# EAGLE board dr1_h (EAGLE 6.4)
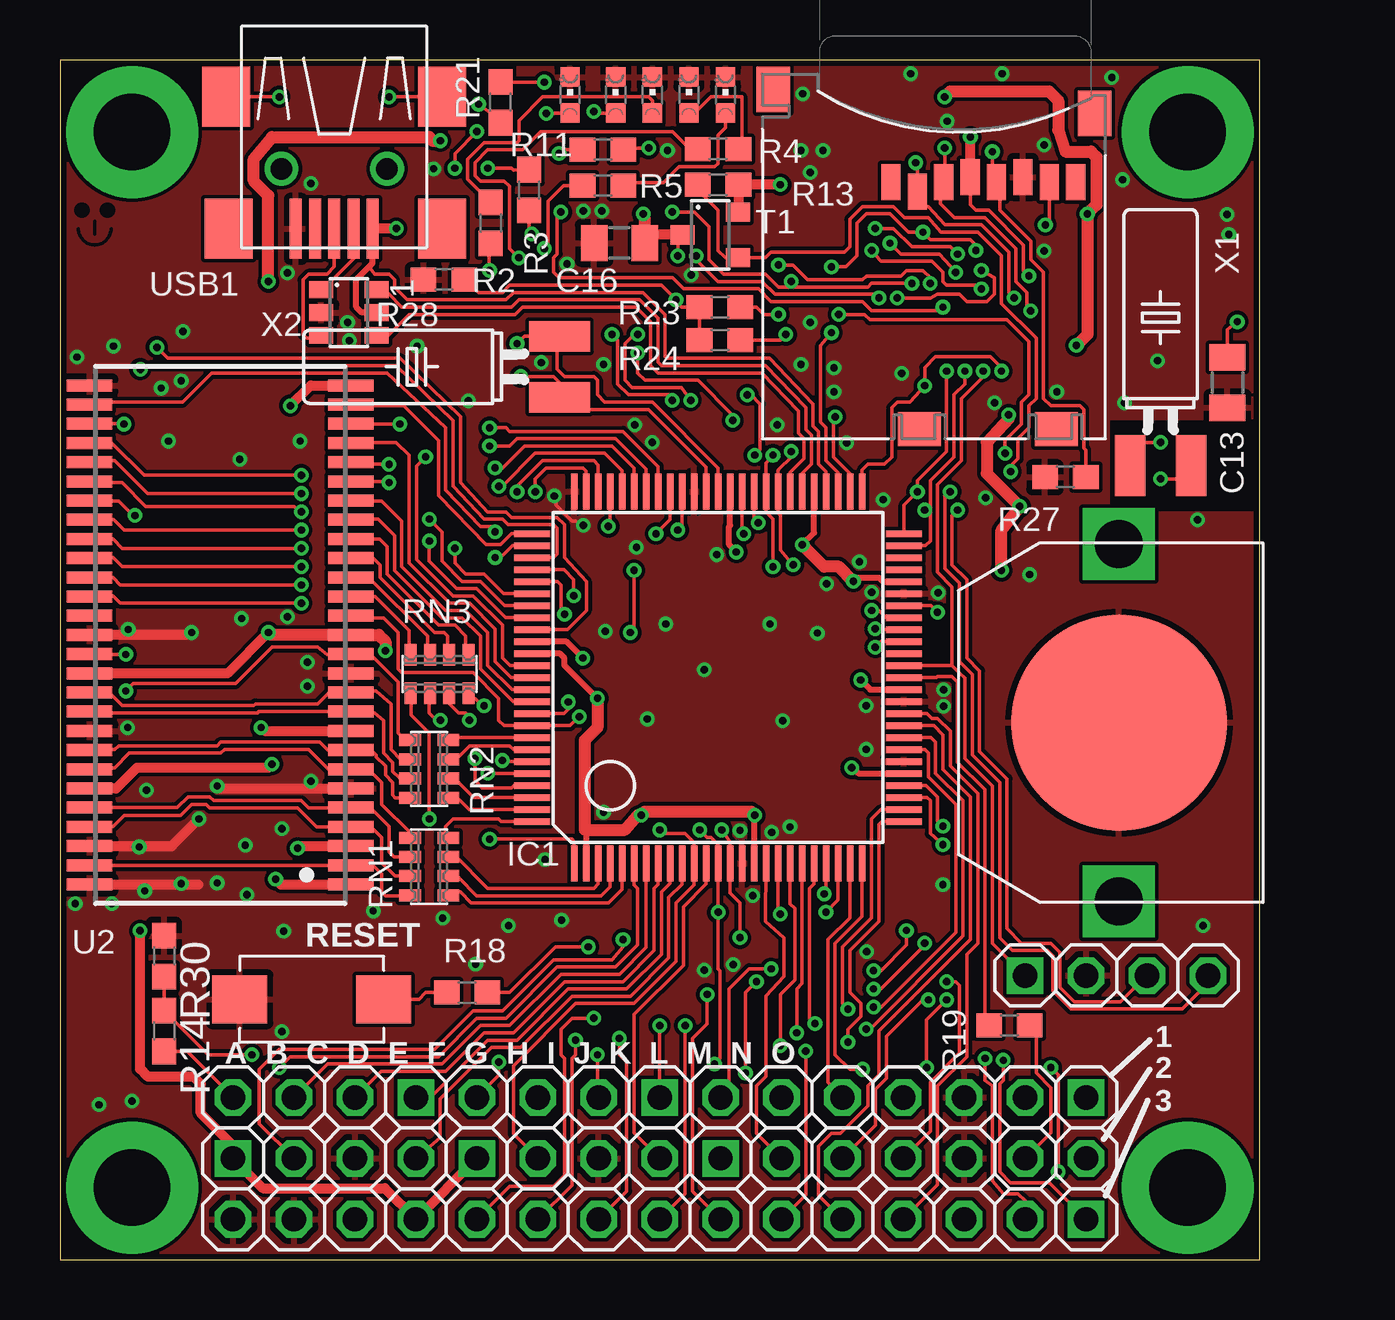
[diagram p1: board, top side]
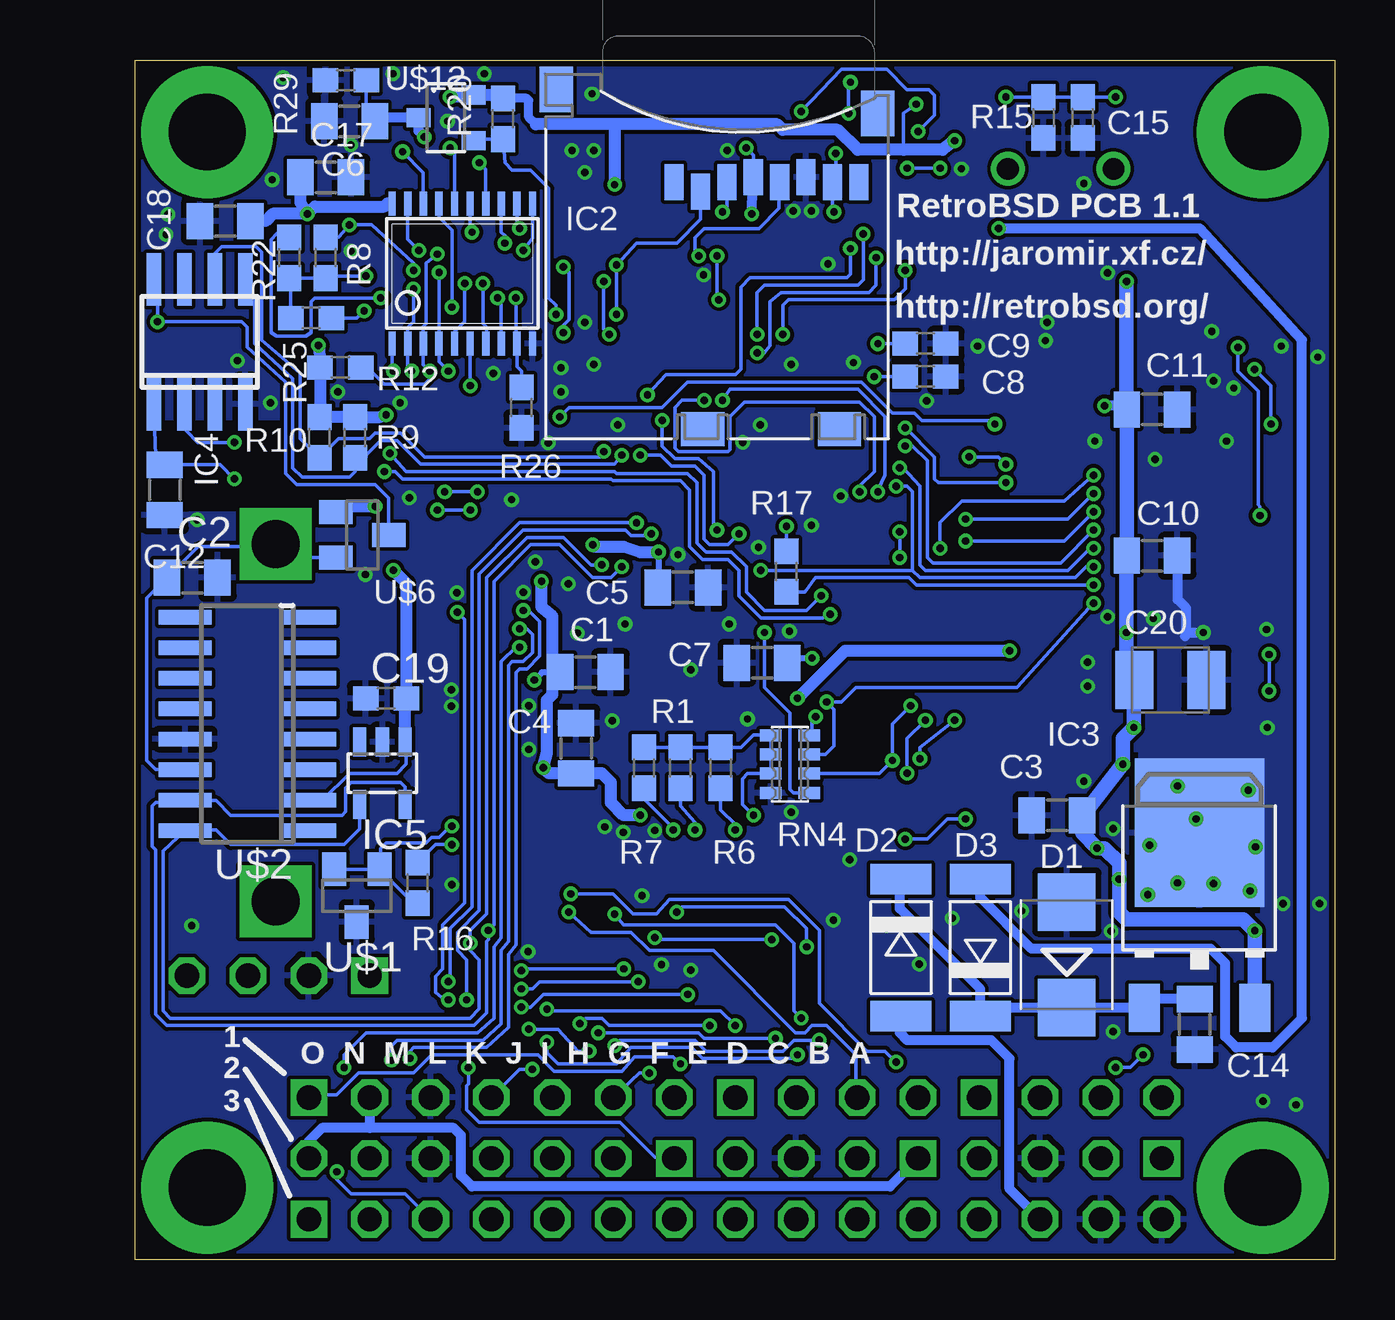
[diagram p2: board, bottom side, seen from below]

Size 50 x 50 mm. Coordinates in mm from the lower left corner, seen from the top.
Outline: 0,0 50,0 50,50 0,50 0,0
Copper layers (1*16): Top 0.035mm / dielectric 1.5mm / Bottom 0.035mm
Design rules "ITead_rule": minimum track width 6mil, minimum drill 12mil, track to track 6mil, track to pad 6mil, pad to pad 6mil, via to via 6mil, smd to smd 0mil, copper to edge 10mil, drill to drill 10mil, minimum pad ring 10mil, minimum via ring 6mil, stop-mask expansion 2mil, vias tented up to drill 100mil, thermal gap 10mil
tRestrict: area 0.7,43.5 to 1.2,44; area 1.7,43.5 to 2.2,44; 2 lines

## Footprints (pad centres in the part's own frame; a part is rotated, then mirrored left to right if it is on the bottom)
SOT23-6 = smd 0.7 x 1: 1 -0.95,-1.15; 2 0,-1.15; 3 0.95,-1.15; 4 0.95,1.15; 5 0,1.15; 6 -0.95,1.15
BATT_KEYS3001 = smd 9 x 9: NEG 0,0 | drill 2 square: POS1 7.45,0; POS2 -7.45,0
R0805 = smd 1.1 x 1.5: 1 -1.05,0; 2 1.05,0
0603 = smd 1.067 x 1: 1 -0.85,0; 2 0.85,0
SMC_B = smd 1.6 x 2.4: + -1.5,0; - 1.5,0
SMB = smd 2.4 x 2.4: A 2.2,0; C -2.2,0
SM-1 = smd 1.27 x 2.54: A 2.857,0; K -2.857,0
TQFP100 = smd 0.27 x 1.5: 1 -6,-9.02; 2 -5.5,-9.02; 3 -5,-9.02; 4 -4.5,-9.02; 5 -4,-9.02; 6 -3.5,-9.02; 7 -3,-9.02; 8 -2.5,-9.02; 9 -2,-9.02; 10 -1.5,-9.02; 11 -1,-9.02; 12 -0.5,-9.02; 13 0,-9.02; 14 0.5,-9.02; 15 1,-9.02; 16 1.5,-9.02; 17 2,-9.02; 18 2.5,-9.02; 19 3,-9.02; 20 3.5,-9.02; 21 4,-9.02; 22 4.5,-9.02; 23 5,-9.02; 24 5.5,-9.02; 25 6,-9.02; 51 6,6.48; 52 5.5,6.48; 53 5,6.48; 54 4.5,6.48; 55 4,6.48; 56 3.5,6.48; 57 3,6.48; 58 2.5,6.48; 59 2,6.48; 60 1.5,6.48; 61 1,6.48; 62 0.5,6.48; 63 0,6.48; 64 -0.5,6.48; 65 -1,6.48; 66 -1.5,6.48; 67 -2,6.48; 68 -2.5,6.48; 69 -3,6.48; 70 -3.5,6.48; 71 -4,6.48; 72 -4.5,6.48; 73 -5,6.48; 74 -5.5,6.48; 75 -6,6.48 | smd 1.5 x 0.27: 26 7.75,-7.27; 27 7.75,-6.77; 28 7.75,-6.27; 29 7.75,-5.77; 30 7.75,-5.27; 31 7.75,-4.77; 32 7.75,-4.27; 33 7.75,-3.77; 34 7.75,-3.27; 35 7.75,-2.77; 36 7.75,-2.27; 37 7.75,-1.77; 38 7.75,-1.27; 39 7.75,-0.77; 40 7.75,-0.27; 41 7.75,0.23; 42 7.75,0.73; 43 7.75,1.23; 44 7.75,1.73; 45 7.75,2.23; 46 7.75,2.73; 47 7.75,3.23; 48 7.75,3.73; 49 7.75,4.23; 50 7.75,4.73; 76 -7.75,4.73; 77 -7.75,4.23; 78 -7.75,3.73; 79 -7.75,3.23; 80 -7.75,2.73; 81 -7.75,2.23; 82 -7.75,1.73; 83 -7.75,1.23; 84 -7.75,0.73; 85 -7.75,0.23; 86 -7.75,-0.27; 87 -7.75,-0.77; 88 -7.75,-1.27; 89 -7.75,-1.77; 90 -7.75,-2.27; 91 -7.75,-2.77; 92 -7.75,-3.27; 93 -7.75,-3.77; 94 -7.75,-4.27; 95 -7.75,-4.77; 96 -7.75,-5.27; 97 -7.75,-5.77; 98 -7.75,-6.27; 99 -7.75,-6.77; 100 -7.75,-7.27
TSSOP20 = smd 0.305 x 0.991: 1 -3.025,-2.818; 2 -2.375,-2.818; 3 -1.725,-2.818; 4 -1.075,-2.818; 5 -0.425,-2.818; 6 0.225,-2.818; 7 0.875,-2.818; 8 1.525,-2.818; 9 2.175,-2.818; 10 2.825,-2.818; 11 2.825,3.018; 12 2.175,3.018; 13 1.525,3.018; 14 0.875,3.018; 15 0.225,3.018; 16 -0.425,3.018; 17 -1.075,3.018; 18 -1.725,3.018; 19 -2.375,3.018; 20 -3.025,3.018
DPAK = smd 1.3 x 2: 1 -2.3,-4.793; 3 2.3,-4.793 | smd 5.4 x 6.2: 4 -0.01,2.5
SO-08 = smd 0.6 x 2.2: 1 -1.905,-2.6; 2 -0.635,-2.6; 3 0.635,-2.6; 4 1.905,-2.6; 5 1.905,2.6; 6 0.635,2.6; 7 -0.635,2.6; 8 -1.905,2.6
SOT23-5L = smd 0.55 x 1.2: 1 -0.95,-1.3; 2 0,-1.3; 3 0.95,-1.3; 4 0.95,1.3; 5 -0.95,1.3
1X15-S = drill 1.016 square: 1 -17.78,0 | drill 1.016 octagon: 2 -15.24,0; 3 -12.7,0; 4 -10.16,0; 5 -7.62,0; 6 -5.08,0; 7 -2.54,0; 8 0,0; 9 2.54,0; 10 5.08,0; 11 7.62,0; 12 10.16,0; 13 12.7,0; 14 15.24,0; 15 17.78,0
1X04-S = drill 1.016 square: 1 -3.81,0 | drill 1.016 octagon: 2 -1.27,0; 3 1.27,0; 4 3.81,0
1X07-S = drill 1.016 square: 1 -7.62,0 | drill 1.016 octagon: 2 -5.08,0; 3 -2.54,0; 4 0,0; 5 2.54,0; 6 5.08,0; 7 7.62,0
CHIPLED_0603 = smd 0.8 x 0.8: A 0,-0.75; C 0,0.75
CTS742C083 = smd 0.5 x 0.9: 1 -1.2,-0.8; 2 -0.4,-0.8; 3 0.4,-0.8; 4 1.2,-0.8; 5 1.2,0.8; 6 0.4,0.8; 7 -0.4,0.8; 8 -1.2,0.8
MICROSD = smd 0.8 x 1.5: 1 -1.94,2.7; 2 -0.84,2.3; 3 0.26,2.7; 4 1.36,2.9; 5 2.46,2.7; 6 3.56,2.9; 7 4.66,2.7; 8 5.76,2.7 | smd 1.4 x 1.9: NC -6.85,6.55; NC3 6.55,5.55 | smd 1.8 x 1.4: NC1 -0.75,-7.6; NC2 4.95,-7.6
SOT23-3 = smd 0.8 x 1: 1 0.91,1.13; 2 -0.99,1.13; 3 -0.04,-1.17
TSOP54 = smd 0.5 x 1.9: 1 -10.4,-5.45; 2 -9.6,-5.45; 3 -8.8,-5.45; 4 -8,-5.45; 5 -7.2,-5.45; 6 -6.4,-5.45; 7 -5.6,-5.45; 8 -4.8,-5.45; 9 -4,-5.45; 10 -3.2,-5.45; 11 -2.4,-5.45; 12 -1.6,-5.45; 13 -0.8,-5.45; 14 0,-5.45; 15 0.8,-5.45; 16 1.6,-5.45; 17 2.4,-5.45; 18 3.2,-5.45; 19 4,-5.45; 20 4.8,-5.45; 21 5.6,-5.45; 22 6.4,-5.45; 23 7.2,-5.45; 24 8,-5.45; 25 8.8,-5.45; 26 9.6,-5.45; 27 10.4,-5.45; 28 10.4,5.45; 29 9.6,5.45; 30 8.8,5.45; 31 8,5.45; 32 7.2,5.45; 33 6.4,5.45; 34 5.6,5.45; 35 4.8,5.45; 36 4,5.45; 37 3.2,5.45; 38 2.4,5.45; 39 1.6,5.45; 40 0.8,5.45; 41 0,5.45; 42 -0.8,5.45; 43 -1.6,5.45; 44 -2.4,5.45; 45 -3.2,5.45; 46 -4,5.45; 47 -4.8,5.45; 48 -5.6,5.45; 49 -6.4,5.45; 50 -7.2,5.45; 51 -8,5.45; 52 -8.8,5.45; 53 -9.6,5.45; 54 -10.4,5.45
SOT23 = smd 1 x 1.4: 1 -0.95,-1.1; 2 0.95,-1.1; 3 0,1.1
SO-16 = smd 0.6 x 2.2: 1 -4.445,-2.917; 2 -3.175,-2.917; 3 -1.905,-2.917; 4 -0.635,-2.917; 5 0.635,-2.917; 6 1.905,-2.917; 7 3.175,-2.917; 8 4.445,-2.917; 9 4.445,2.283; 10 3.175,2.283; 11 1.905,2.283; 12 0.635,2.283; 13 -0.635,2.283; 14 -1.905,2.283; 15 -3.175,2.283; 16 -4.445,2.283
SW_SMD_MINI = smd 2.3 x 2: 1 3,0; 2 -3,0
USB-MB-S = smd 2.5 x 0.5: D+ 2.5,0; D- 2.5,0.8; GND 2.5,-1.6; ID 2.5,-0.8; VBUS 2.5,1.6 | smd 2.5 x 2: GND@1 -3,4.5; GND@2 2.5,4.5; GND@3 -3,-4.5; GND@4 2.5,-4.4 | drill 0.9: P$5 0,2.2; P$6 0,-2.2
TC38 = smd 1.27 x 2.54: P$1 -1.27,-4.572; P$2 1.27,-4.572

## Placement (x,y rotation side)
1  WE_TVS_2USB  [SOT23-6]  12.04,39.47 270 top
B1  BATT_3001  [BATT_KEYS3001]  44.15,22.38 270 top
C1  1U  [R0805]  31.24,24.49 0 bottom
C2  1U  [R0805]  47.62,28.42 0 bottom
C3  10U  [R0805]  11.58,18.52 180 bottom
C4  10U  [R0805]  31.62,21.31 90 bottom
C5  1U  [R0805]  27.18,28.02 0 bottom
C6  10U  [R0805]  41.07,47.45 180 bottom
C7  10U  [R0805]  23.88,24.87 180 bottom
C8  22P  [0603]  17.07,36.8 0 bottom
C9  22P  [0603]  17.07,38.18 0 bottom
C10  10U  [R0805]  7.62,29.34 0 bottom
C11  1U  [R0805]  7.62,35.43 0 bottom
C12  15P  [R0805]  48.77,32.08 270 bottom
C13  1U  [R0805]  48.67,36.55 270 top
C14  10U  [R0805]  5.84,9.8 270 bottom
C15  1U  [0603]  10.52,47.6 90 bottom
C16  10U  [R0805]  23.32,42.37 180 top
C17  10U  [R0805]  42.06,45.11 0 bottom
C18  DNP  [R0805]  46.25,43.28 180 bottom
C19  1U  [0603]  39.55,23.39 0 bottom
C20  [SMC_B]  6.86,24.16 0 bottom
D1  P6KE6V8A  [SMB]  11.18,12.7 90 bottom
D2  1N5818  [SM-1]  18.08,13 270 bottom
D3  1N5818  [SM-1]  14.78,13 90 bottom
IC1  PIC32MX795F512L-TQFP  [TQFP100]  27.43,25.53 0 top
IC2  74244TSSOP20  [TSSOP20]  36.27,41 0 bottom
IC3  LF33-DPAK  [DPAK]  5.64,15.29 0 bottom
IC4  PCF8563_SO8  [SO-08]  47.32,38.25 0 bottom
IC5  MCP9800-SOT  [SOT23-5L]  39.7,20.27 180 bottom
JP1  [1X15-S]  24.99,1.68 180 top
JP2  [1X04-S]  21.18,4.22 0 top
JP3  [1X04-S]  11.02,6.76 180 top
JP4  [1X04-S]  21.18,6.76 180 top
JP5  [1X04-S]  11.02,4.22 0 top
JP6  [1X07-S]  35.15,4.22 0 top
JP7  [1X07-S]  35.15,6.76 180 top
JP8  [1X04-S]  44.04,11.84 0 top
LED1  [CHIPLED_0603]  24.69,48.54 0 top
LED2  [CHIPLED_0603]  23.16,48.54 0 top
LED3  [CHIPLED_0603]  26.21,48.54 0 top
LED4  [CHIPLED_0603]  27.74,48.54 0 top
LED5  [CHIPLED_0603]  21.26,48.54 0 top
R1  30K  [0603]  27.28,20.5 90 bottom
R2  470R  [0603]  17.96,43.21 90 top
R3  470R  [0603]  19.56,44.58 90 top
R4  470R  [0603]  27.43,46.28 0 top
R5  470R  [0603]  22.63,44.75 0 top
R6  30k  [0603]  25.6,20.5 270 bottom
R7  30k  [0603]  28.8,20.5 270 bottom
R8  30K  [0603]  42.06,41.76 90 bottom
R9  2K2  [0603]  40.84,34.26 90 bottom
R10  2K2  [0603]  42.32,34.26 90 bottom
R11  30K  [0603]  22.63,46.25 0 top
R12  30K  [0603]  41.45,37.19 180 bottom
R13  30K  [0603]  27.43,44.81 180 top
R14  200R  [0603]  4.34,9.53 270 top
R15  200R  [0603]  12.14,47.6 90 bottom
R16  470R  [0603]  38.23,15.7 90 bottom
R17  200  [0603]  22.86,28.68 90 bottom
R18  200  [0603]  16.97,11.13 180 top
R19  200R  [0603]  39.57,9.75 0 top
R20  30K  [0603]  34.67,47.55 90 bottom
R21  470R  [0603]  18.36,48.23 90 top
R22  30K  [0603]  43.59,41.76 270 bottom
R23  30K  [0603]  27.51,39.7 180 top
R24  30K  [0603]  27.51,38.33 180 top
R25  30K  [0603]  42.67,39.24 0 bottom
R26  30K  [0603]  33.91,35.51 90 bottom
R27  30K  [0603]  41.91,32.61 0 top
R28  30K  [0603]  16,40.84 0 top
R29  30K  [0603]  41.22,49.15 0 bottom
R30  30k  [0603]  4.34,12.65 270 top
RN1  100R  [CTS742C083]  15.39,16.38 90 top
RN2  100R  [CTS742C083]  15.39,20.45 90 top
RN3  100R  [CTS742C083]  15.82,24.41 180 top
RN4  10k  [CTS742C083]  22.71,20.65 90 bottom
SD1  SF-MICROSD  [MICROSD]  36.58,42.21 0 top
SD2  SF-MICROSD  [MICROSD]  25.6,42.21 0 bottom
T1  SI2333  [SOT23-3]  27.13,42.67 270 top
U2  K4S561632E-TC  [TSOP54]  6.68,26.04 90 top
U$1  TL431_SOT23  [SOT23]  40.77,15.16 180 bottom
U$2  DS3231  [SO-16]  45.64,22.33 90 bottom
U$6  BAV70  [SOT23]  40.54,30.2 270 bottom
U$8  SWITCH_MINI  [SW_SMD_MINI]  10.49,10.85 180 top
U$12  SI2333  [SOT23-3]  37.03,47.55 270 bottom
USB1  USB-MB-S  [USB-MB-S]  11.43,45.47 270 top
X1  32768  [TC38]  45.87,37.67 0 top
X2  12MHz  [TC38]  16.26,37.21 90 top

## Tracks (layer width: path | path; a pad name or v marks a point on that pad's centre or on a via)
+3V3  (via drill 0.3)
  Top 0.152: v28.96,18.52 28.93,18.49 | R21.1 18.3,47.54 v17.45,48.16
  Top 0.254: IC1.37 33.77,23.76 v33.38,24.16 | IC1.30 33.31,20.26 v32.99,20.5 | IC1.62 27.93,30.6 27.89,30.56 27.89,29.79 v28.19,29.49 | IC1.86 20.84,25.26 21.03,25.07 21.03,24.77 v22.4,23.39 | IC1.2 21.93,17.89 21.87,17.91 | 28.8,18.67 v28.96,18.52 | 24.08,18.52 v24.23,18.52 | 28.93,18.49 IC1.16 | IC1.46 34.3,28.26 34.14,28.42 33.22,28.42 v33.07,28.27 | IC1.55 31.43,30.29 v30.94,29.79
  Top 0.406: U2.27 10.45,36.44 v9.6,35.59 | 8.76,26.06 8.74,26.11 8.79,26.11 8.76,26.06 | 8.76,26.06 v8.69,26.14 6.99,24.43 U2.43 | U2.3 10,17.23 v9.91,17.14 | U2.1 9.21,15.63 v8.99,15.85 | U2.9 8.52,22.04 v8.38,22.17 | U2.49 2.34,19.64 3.2,20.5 8.69,20.5 v8.84,20.65 | JP2.1 JP1.12 13.54,2.97 8.46,2.97 JP5.1 7.16,4.8 5.87,6.1 5.87,7.32 5.56,7.62 3.66,7.62 3.34,7.94 v3.34,13.7 | T1.2 28.28,43.69 R13.1 v30.02,44.81
  Top 0.508: v22.4,23.39 22.4,22.17 21.87,21.64 21.87,17.91 23.55,17.91 24.08,18.52 | v24.23,18.52 24.38,18.67 28.8,18.67 | v13.56,25.38 13.56,25.76 13.28,26.04 U2.14 8.79,26.04 v8.69,26.14 | v8.69,40.77 8.69,44.35 8.08,44.96 8.08,45.87 8.84,46.79 15.39,46.79 15.54,46.63 v15.85,46.63 | v36.88,48.46 37.11,48.69 41.22,48.69 41.6,48.31 41.6,47.09 41.91,46.18 42.98,46.18 43.2,45.95 43.2,43.97 v42.82,43.59 42.82,38.56 v42.37,38.1 | v30.94,29.79 31.85,28.88 32.46,28.88 v33.07,28.27 | v39.55,35.2 39.55,35.05 38.63,34.06 38.63,32.77 v40.01,31.39 39.24,30.4 v39.24,28.73
  Bottom 0.152: 28.19,28.36 C5.1 | RN4.6 RN4.7 24.48,20.25 24.69,20.04 24.69,18.97 v24.23,18.52 | RN4.6 RN4.5 23.53,21.87 24.23,21.87 24.75,21.35 R6.1 R1.2 R7.1 | RN4.6 23.57,21.11 | v17.45,48.16 17.98,47.78 17.98,46.25 | 42.29,35.14 R10.2 42.3,35.13 | 42.3,37.43 R12.2 | 31.54,20.1 C4.1 | 41.15,31.39 41.62,31 U$6.1 | U$2.2 42.19,19.15 41.07,20.27 39.09,20.27 38.71,20.65 38.71,21.53 IC5.1 | 38.75,23.34 C19.2
  Bottom 0.254: v28.19,29.49 28.19,28.36 | v30.94,29.79 30.86,29.72 | v33.38,24.16 33.05,24.48 32.61,24.48 32.68,24.49 C1.1 | 39.5,44.01 IC2.20
  Bottom 0.381: R20.2 33.69,48.4 33.6,48.31 33.6,47.62 33.3,47.32
  Bottom 0.406: v9.6,35.59 8.82,35.59 C11.1 8.69,35.45 | 8.69,29.32 C10.1 | 10.53,17.77 C3.1 10.52,18.52 | 40.23,5.49 36.73,5.49 36.42,5.18 36.42,3.5 35.97,3.05 18.54,3.05 JP2.1 | 40.23,5.49 42.22,5.49 42.77,4.93 JP6.7 | U$12.2 35.98,48.46 | R20.2 34.73,48.54 | v42.82,43.59 42.9,43.59 | JP7.2 40.23,5.49
  Bottom 0.508: 30.86,29.72 29.64,29.72 28.96,29.49 v28.19,29.49 | v13.56,25.38 20.42,25.38 v22.4,23.39 | 35.98,48.46 v36.88,48.46 | 34.73,48.54 U$12.2 | C17.1 43.11,44.06 v42.82,43.59 42.52,43.89 39.62,43.89 39.5,44.01 | 30.02,47.32 33.3,47.32 | 30.02,47.32 23.24,47.32 23.01,47.09 20.73,47.09 19.89,46.25 17.98,46.25 16.36,46.25 v15.85,46.63 | 30.02,47.32 v30.02,44.81 | v28.96,18.52 29.64,18.52 30.18,19.05 30.18,19.89 30.55,20.26 C4.1 32.77,20.27 v32.99,20.5 32.99,20.57 32.84,21.11 32.84,23.32 32.61,23.55 32.61,24.48 32.61,26.82 33.07,27.2 v33.07,28.27 | v42.37,38.1 42.3,37.43 | R12.2 42.3,35.13 | C18.1 44.58,43.28 44.27,43.59 42.9,43.59 | v39.55,35.2 39.79,35.12 R9.2 R10.2 | v40.01,31.39 41.15,31.39 | IC5.1 38.75,23.34 | C19.2 38.7,28.18 v39.24,28.73
  Bottom 0.61: C10.1 C11.1 | 8.69,29.32 v8.69,26.14 8.69,24.16 C20.+ 8.38,24.16 v8.38,22.17 8.84,21.72 v8.84,20.65 10.52,18.52 | 10.53,17.77 v9.91,17.14 9.6,17.14 8.99,16.54 v8.99,15.85 8.99,14.48 8.69,14.17 3.81,14.17 v3.34,13.7 IC3.3 | 8.69,35.45 v8.69,40.77
+5V
  Bottom 0.406: C14.1 7.58,10.85 IC3.1 D1.C 14.43,10.5 D3.K 14.78,11.28 18.14,14.63 18.14,15.81 D2.K
D+
  Top 0.152: IC1.57 30.43,32.79 31.01,33.38 31.01,34.21 30.79,34.44 30.79,35.36 29.26,36.96 24.92,36.96 24.61,37.26 24.61,39.09 24,39.7 19.28,39.7 18.97,39.4 14.55,39.4 13.56,38.41 13.22,38.41 1.4
D-
  Top 0.152: IC1.56 30.94,32.77 31.32,33.15 31.32,34.37 31.09,34.59 31.09,35.51 29.41,37.26 25.07,37.26 24.92,37.41 24.92,39.24 24.16,40.01 19.13,40.01 18.82,39.7 14.25,39.7 13.72,40.23 13.22,40.23 1.6
GND  (via drill 0.3)
  Top 0.152: LED5.C 20.89,49.21 | 20.68,31.98 20.68,31.45 21.34,30.79 21.49,30.79 21.57,30.71
  Top 0.406: U2.52 4.66,17.23 v5.79,18.36 | U2.54 5.78,15.63 | U2.6 6.65,19.64 v6.55,19.74 | U2.41 5.38,26.04 v5.49,26.14
  Bottom 0.152: 6.25,25.98 6.2,26.04
  Bottom 0.406: 6.25,25.98 | 5.79,17.16 v5.79,18.36 5.79,19.89 6.1,20.19 v6.55,19.74 | 6.2,26.04 6.2,26.14 | 6.2,26.14 6.2,27.15 6.55,27.51 6.55,29.32 C10.2 | 6.2,26.14 v5.49,26.14
  other vias: 6.55,15.7 33.83,27.81 33.6,21.26 28.35,17.88 25.25,26.49 31.95,28.17 24.49,22.53 36.83,23.06 10.46,44.86 9.47,41.12 11.99,39.07 14.88,38.07 24.69,34.06 4.22,36.32 0.71,37.62 2.24,38.07 2.84,26.26 10.46,19.94 3.3,17.2 2.16,14.83 0.64,14.83 4.52,34.11 10.01,34.11 1.63,6.45 36.6,27.79 5.13,38.68 9.25,17.96 17.02,35.79 22.66,37.31 23.95,34.8 45.75,37.47 38.58,31.75 41.02,46.46 30.89,46.23 31.8,46.23 15.57,45.47 39.27,49.43 32.26,37.16 36.98,47.45 30.96,48.59 31.27,45.31 38.96,35.71 20.07,37.39 31.57,26.11 30.12,22.45 29.67,17.81 28.88,15.16 32.26,36.17 21.82,43.71 22.58,43.71 25.32,46.23 35.46,49.43 3,6.6 9.25,9.5 17.32,12.32 30.43,18.03 18.69,13.92 20.9,14.15 22.73,26.19 24.03,29.69 47.42,30.84 2.82,22.17 5.05,36.63 27.38,29.39 3.61,19.56 3.53,15.37 7.72,17.27 7.8,15.21 43.84,49.28 48.64,43.56 44.3,45.01 31.27,39.07 30.89,37.31 48.72,42.72 15.95,14.22 13.06,14.53 9.32,13.69 44.37,35.71 26.85,24.59 29.59,26.49 33.6,23.09 36.83,23.75 28.07,12.29 26.85,12.06 47.65,13.92 40.41,28.55 10.31,24.89 10.31,23.9 9.47,26.8 22.66,18.64 33.63,12.83 5.05,15.67 36.8,15.62 26.31,41.05 20.22,16.66 41.55,36.17 35.08,36.93 41.02,42.04 34.32,31.67 33.32,29.08 29.9,34.8 32.79,34.04 20.6,31.83 21.82,30.61 7.49,33.35 7.57,26.72 21.13,41.5 12.06,38.3
  pour Bottom: -1,-1 51,-1 50.78,31.11 43.69,31.11 43.69,35.05 50.78,35.05 51,51 -1,51
  pour Top: -1,-1 51,-1 50.78,31.11 43.69,31.11 43.69,35.05 50.78,35.05 51,51 -1,51
  pour Bottom (no thermals): 2.29,14.22 3.05,14.22 3.05,20.57 8.13,20.57 8.13,21.59 2.29,21.59
  pour Top: 20.88,31.24 20.88,31.39 20.95,31.85
MCLR  (via drill 0.3)
  Top 0.152: v26.67,17.91 26.98,17.6 27.13,17.6 27.43,17.3 IC1.13 v27.43,14.48 27.43,12.12 27.51,12.04 27.51,8.38 v27.28,8.15 | R18.1 18.75,11.12 20.65,13.03 v22.02,13.03
  Bottom 0.152: v26.67,17.91 26.67,18.21 27.28,18.9 R1.1 | v22.02,13.03 22.02,13.79 22.94,14.71 27.2,14.71 v27.43,14.48 | v27.28,8.15 27.58,8.46 29.18,8.46 29.72,7.85 32.54,7.85 33.22,8.53 37.64,8.53 38.41,7.77 40.69,7.77 41.6,6.86 42.67,6.86 JP7.1
MISO4  (via drill 0.3)
  Top 0.152: v37.41,41.91 37.11,42.22 35.51,42.22 34.75,42.98 v33.98,42.98 | IC1.49 36.08,29.76 36.27,29.95 36.27,31.24 | 36.27,31.24 36.27,32.46 37.26,33.45 37.26,36.04 37.72,36.5 v37.72,37.03 | JP8.3 45.29,11.84 44.2,10.74 42.29,10.74 41.68,11.35 41.68,12.8 41.3,13.18 40.08,13.18 39.47,13.79 39.47,20.04 38.33,21.18 38.33,24.54 37.8,25.07 37.8,28.35 37.19,28.96 37.19,31.01 v37.41,31.24 | v36.04,31.24 36.27,31.24
  Bottom 0.152: v37.41,41.91 37.87,41.53 37.87,39.01 38,38.89 IC2.3 38,37.31 v37.72,37.03 37.72,36.73 37.95,36.5 39.62,36.5 40.31,37.19 R12.1 41.06,37.63 | v37.41,31.24 v36.04,31.24 | IC2.12 34.1,43.09 v33.98,42.98
MOSI4  (via drill 0.3)
  Top 0.152: v37.34,41.15 36.65,41.91 35.05,41.91 v34.59,42.37 | JP8.4 47.85,11.51 46.79,10.44 42.14,10.44 41.38,11.2 41.38,12.65 41.15,12.88 39.7,12.88 39.17,13.41 39.17,19.89 38.02,21.03 38.02,24.38 37.49,24.92 37.49,28.19 36.88,28.8 36.88,31.85 37.03,32 v37.11,32 | IC1.50 35.18,31.45 v35.74,32 35.74,32.46 36.96,33.68 v36.96,37.03
  Bottom 0.152: v34.59,42.37 34.59,42.67 34.75,42.82 IC2.13 | v36.96,37.03 37.35,37.42 IC2.4 37.35,38.85 37.34,38.86 v37.34,41.15 | v37.11,32 v35.74,32
N$1  (via drill 3.2 pad 5.5)
  other vias: 3,3
N$2  (via drill 3.2 pad 5.5)
  other vias: 47,3
N$3  (via drill 3.2 pad 5.5)
  other vias: 3,47
N$4  (via drill 0.3)
  Top 0.152: IC1.63 27.43,32.99 24.69,35.74 22.71,35.74 22.4,36.04 22.4,36.65 22.25,36.8 21.03,36.8 20.73,37.11 20.73,38.38 X2.P$2 19.36,38.48 v19.05,38.18
  Bottom 0.152: C9.1 v19.05,38.18
N$5
  Top 0.152: JP6.6 41.3,5.28 41.3,7.16 40.69,7.77 40.69,9.49 R19.2
N$6  (via drill 3.2 pad 5.5)
  other vias: 47,47
N$7  (via drill 0.3)
  Top 0.152: v45.87,34.06 44.96,34.06 44.65,33.76 44.65,32.38 X1.P$1
  Bottom 0.152: IC4.2 47.88,34.54 47.4,34.06 v45.87,34.06
N$8  (via drill 0.3)
  Top 0.152: v38.86,46.18 38.86,45.57 39.01,45.41 39.01,44.94 SD1.5 39.17,44.78 39.17,43.74 40.46,42.44 40.46,41.68 41,41.15 41,35.89 41.3,35.59 42.52,35.59 42.67,35.43 42.67,33.83 42.76,33.74 R27.2
  Bottom 0.152: IC2.18 38,45.31 v38.86,46.18
N$9  (via drill 0.3)
  Top 0.152: v36.88,46.33 36.88,44.96 SD1.3 36.7,44.77 IC2.16 37.28,43.43 38.56,43.43 39.85,42.14 39.85,40.77 40.31,40.31 40.31,39.7 v40.46,39.55
  Bottom 0.152: IC2.16 36.7,46.15 v36.88,46.33 | R25.2 40.77,39.24 v40.46,39.55
N$10  (via drill 0.3)
  Top 0.152: v45.87,32.54 46.94,32.54 X1.P$2
  Bottom 0.152: IC4.1 49.15,33.51 C12.1 46.47,33.13 v45.87,32.54
N$11
  Top 0.152: LED1.A 24.69,48.31 24.54,48.46 20.12,48.46 19.13,47.47 19.13,46.63 19.05,46.56 17.68,46.56 16.99,45.87 16.99,45.03 17.54,44.49 17.83,44.49 R2.2
N$12  (via drill 0.3)
  Top 0.152: LED2.A 22.32,47.79 v22.25,47.85 | v16.46,45.49 16.46,46.1 v17.37,47.02 | v17.83,45.49 18.82,45.49 18.9,45.41 R3.2
  Bottom 0.152: v22.25,47.85 20.57,49.61 18.67,49.61 17.83,48.77 16.92,48.77 16.69,48.54 16.69,47.7 v17.37,47.02 | v16.46,45.49 v17.83,45.49
N$13
  Top 0.152: LED3.A 26.38,47.71 27.13,48.46 28.42,48.46 28.42,46.57 R4.2
N$14
  Top 0.152: 23.1,45.02 R5.2 23.13,44.88 25.15,44.88 25.81,45.54 27.28,45.54 27.43,45.67 27.43,46.86 27.74,47.17 LED4.A
N$15  (via drill 0.3)
  Top 0.152: C13.1 48.67,38.76 v49.07,39.09
  Bottom 0.152: IC4.8 49.07,40.7 v49.07,39.09 45.57,39.09 45.34,38.86 45.34,38.02 43.74,36.58 43.74,32.77 43.28,32.31 40.01,32.31 39.44,31.74 U$6.3
N$16
  Bottom 0.152: U$6.2 43.49,29.25 B1.POS2 44.26,29.72 47.38,29.72 C2.1 49.53,27.57 49.53,20.8 49.15,20.42 U$2.14
N$17  (via drill 0.3)
  Top 0.152: v9.14,48.46 7.08,48.46 USB1.GND@3 | v13.72,48.46 16.08,48.46 USB1.GND@1
  Bottom 0.152: v9.14,48.46 9.16,48.45 C15.2 R15.2 13.7,48.45 v13.72,48.46
N$18
  Bottom 0.406: D2.A 18.14,10.1 18.14,9.45 17.83,9.14 14.33,9.14 13.56,8.38 13.56,2.95 JP1.13
N$19  (via drill 0.3)
  Top 0.152: IC1.64 26.93,33.04 24.54,35.43 21.08,35.43 X2.P$1 20.83,36.55 20.57,36.8 v19.2,36.8
  Bottom 0.152: C8.1 v19.2,36.8
N$20  (via drill 0.3)
  Top 0.152: v2.74,23.7 3.05,24 7.32,24 8.84,25.53 10.74,25.53 11.12,25.22 U2.13 12.07,25.22 12.95,25.22 14.1,24.08 14.1,21.95 14.4,21.64 14.4,21.68 RN2.5 | v2.74,25.22 1.17,25.22 U2.42
  Bottom 0.152: v2.74,25.22 v2.74,23.7
N$21
  Top 0.152: RN2.6 14.21,20.85 13.79,21.26 13.79,23.16 13.18,23.7 12.12,23.7 U2.11 12.12,23.62 11.2,23.62 10.74,23.16 8.15,23.16 8.08,23.09 2.59,23.09 2.04,23.64 U2.44
N$22
  Top 0.152: 14.17,20.05 RN2.7 | 14.17,20.05 13.87,20.34 13.87,20.73 13.49,21.11 13.49,22.48 13.11,22.78 12.11,22.78 U2.10 8.28,22.84 8.23,22.78 1.21,22.78 U2.45 | 14.17,20.04 14.17,20.05
N$23
  Top 0.152: RN2.8 13.98,19.25 13.87,19.36 13.87,19.89 13.56,20.19 13.56,20.57 13.18,20.95 13.18,21.03 12.95,21.26 12.08,21.26 U2.8 11.15,21.23 10.82,21.57 6.71,21.57 6.55,21.41 2.44,21.41 2.29,21.26 1.18,21.26 U2.47
N$24
  Top 0.152: RN1.5 14.59,17.79 13.41,18.97 13.41,19.89 12.95,20.34 12.14,20.34 U2.7 11.19,20.43 10.36,21.26 6.86,21.26 6.71,21.11 2.9,21.11 2.29,20.5 1.22,20.5 U2.48
N$25
  Top 0.152: RN1.6 13.93,16.78 13.72,16.99 13.72,18.06 12.95,18.82 12.07,18.82 U2.5 12.04,18.82 10.36,18.82 10.06,19.13 6.4,19.13 6.25,19.28 5.33,19.28 4.89,18.84 U2.50
N$26
  Top 0.152: RN1.7 13.96,15.98 13.41,16.54 13.41,17.6 12.95,18.06 12.08,18.06 U2.4 10.69,18.04 9.91,18.82 6.25,18.82 6.1,18.97 5.49,18.97 5.03,18.52 2.67,18.52 2.21,18.06 1.18,18.06 U2.51
N$27
  Top 0.152: RN1.8 14.42,15.16 13.56,15.16 13.41,15.32 13.41,16.08 13.05,16.43 U2.2 U2.53
N$28
  Top 0.152: U2.18 13.06,29.23 13.34,28.96 13.34,28.42 15.62,26.14 16,26.14 16.15,25.98 16.15,25.37 RN3.2
N$29
  Top 0.152: U2.17 12.87,28.43 15.32,25.98 15.32,25.39 RN3.3
N$30
  Top 0.152: U2.16 13.13,27.64 14.55,26.21 14.55,25.36 RN3.4
N$31
  Top 0.152: U2.19 13.32,30.04 13.64,29.72 13.64,28.57 15.77,26.44 16.46,26.44 16.92,25.98 16.92,25.39 RN3.1
N$32
  Top 0.152: U$8.2 14.96,10.85 15.24,11.12 R18.2
N$33  (via drill 0.3)
  Top 0.152: v10.06,28.12 2.52,28.12 2.21,28.42 1.17,28.42 U2.38
  Bottom 0.152: v10.06,28.12 17.45,28.12 17.75,28.42 21.64,28.42 22.08,27.83 R17.1
N$34  (via drill 0.3)
  Top 0.152: v35.66,45.72 35.74,45.65 SD1.2 35.74,44.12 35.97,43.89 36.2,43.89 36.88,43.13 38.41,43.13 39.55,41.99 39.55,40.31 v39.78,40.08
  Bottom 0.152: R22.1 44.11,42.76 44.35,42.52 44.35,38.63 44.12,38.48 42.9,38.48 42.67,38.63 42.67,39.93 42.52,40.08 v39.78,40.08 | IC2.14 35.4,45.45 v35.66,45.72
N$35  (via drill 0.3)
  Top 0.152: v34.9,40.08 36.27,40.08 36.58,40.23 37.49,40.23 37.8,39.93 38.63,39.93 38.94,40.23 38.94,40.92 v38.41,41.22 | SD1.7 41.24,43.37 v41.07,43.13
  Bottom 0.152: IC2.8 34.75,39.93 v34.9,40.08 | v38.41,41.22 38.41,41.53 40.16,43.13 v41.07,43.13 41.52,42.61 R8.2
N$36  (via drill 0.3)
  Top 0.152: v34.14,40.08 33.98,40.23 29.79,40.23 29.26,40.77 27.43,40.77 26.52,41.68 v26.52,41.83
  Bottom 0.152: v34.14,40.08 34.14,38.3 IC2.9 34.1,37.22 33.91,37.03 R26.2 | SD2.5 23.16,44.89 23.16,43.81 24,42.98 26.29,42.98 26.67,42.6 26.67,41.99 v26.52,41.83
N$37  (via drill 0.3)
  Top 0.254: IC1.85 21.11,25.76 v21.79,25.07
  Bottom 0.254: v21.79,25.07 22.62,25.07 C7.1
N$38  (via drill 0.3)
  Top 0.152: 30.48,40.54 29.95,40.54 29.41,41.07 27.66,41.07 27.05,41.68 27.05,43.05 26.44,43.66 v25.53,43.66 | 30.48,40.54 33.68,40.54 33.83,40.69 v35.51,40.69 | R24.1 30.02,38.33 v30.25,38.56 | v30.48,40.77 30.48,40.54
  Bottom 0.152: v35.51,40.69 35.36,40.54 35.51,40.39 35.51,39.01 35.36,38.86 35.36,38.29 IC2.7 | SD2.3 25.34,43.85 v25.53,43.66 | v30.25,38.56 30.48,38.79 v30.48,40.77
N$39  (via drill 0.3)
  Top 0.152: v29.95,41.45 30.56,41.45 31.17,40.84 33.45,40.84 33.6,41 35.05,41 35.28,41.22 35.97,41.22 36.27,40.92 v36.27,40.69 | R23.1 29.03,39.7 29.34,39.4 v29.95,39.4
  Bottom 0.152: v36.27,40.69 36.27,39.09 36.73,38.63 36.73,38.36 IC2.5 | v29.95,39.4 v29.95,41.45 29.11,42.37 27.43,42.37 26.44,43.36 SD2.2
N$40
  Top 0.152: USB1.D- 12.23,41.72 11.28,40.77 11.28,40.66 1.1
N$41  (via drill 0.3)
  Top 0.152: LED5.A 20.42,47.78 v20.27,47.78 | v20.19,49.07 18.81,49.07 R21.2
  Bottom 0.152: v20.27,47.78 20.27,48.84 20.19,48.92 v20.19,49.07
N$42
  Top 0.152: R14.2 5.29,8.68 JP3.4
N$43  (via drill 0.3)
  Top 0.152: v36.8,39.7 36.58,39.55 33.83,39.55 33.45,39.93 29.64,39.93 29.11,40.46 25.98,40.46 25.53,40.92 20.8,40.92 20.57,41.15 20.57,41.76 20.73,41.91 20.73,43.51 v20.88,43.66 | R11.1 20.88,46.25 v20.8,46.1
  Bottom 0.152: v20.88,43.66 20.94,43.65 SD2.7 20.8,45.05 v20.8,46.1 | v36.8,39.7 36.8,42.9 37.35,43.44 IC2.17
N$44
  Top 0.152: USB1.D+ 11.43,41.38 11.12,41.07 10.36,41.07 10.13,40.84 10.13,38.56 10.29,38.41 10.85,38.41 1.3
N$48  (via drill 0.3)
  Top 0.152: v40.39,41 40.16,41.22 40.16,42.29 38.71,43.74 38.18,43.74 37.95,43.97 SD1.4 37.95,45.13
  Top 0.406: 37.95,45.13 v37.95,46.79
  Bottom 0.152: v40.39,41 41.85,40.98 R8.1 R22.2 43.52,40.84 R25.1 | R29.2 40.37,47.8 C6.1
  Bottom 0.406: C6.1 40.09,47.59 U$12.3 38.2,47.04 v37.95,46.79
N$49  (via drill 0.3)
  Top 0.152: v25.76,41.83 25.76,42.36 T1.3 | v24.54,46.33 23.55,46.33 23.55,46.32 R11.2 | R28.2 16.92,40.84 17.45,40.31 18.44,40.31 18.75,40.62 25.07,40.62 v25.68,40.01 25.68,39.93 25.91,39.7 R23.2 R24.2
  Top 0.406: T1.3 24.41,42.71 | 24.37,43.38 v24.31,43.59
  Top 0.508: 24.37,43.38 C16.1 24.41,42.41 24.41,42.71
  Bottom 0.152: v25.68,40.01 25.68,40.08 25.76,40.16 v25.76,41.83 | v24.54,46.33 24.23,46.02 24.23,45.13 SD2.4
  Bottom 0.406: v24.31,43.59 SD2.4
PGC
  Top 0.152: IC1.24 32.92,14.25 32,13.34 32,7.39 32.54,6.86 32.54,6.83 JP7.5
PGD  (via drill 0.3)
  Top 0.152: IC1.25 33.43,14.31 32.31,13.18 32.31,8.53 32.92,7.92 v33.45,7.92
  Bottom 0.152: JP7.4 33.98,7.92 v33.45,7.92
RA6  (via drill 0.3)
  Top 0.152: IC1.91 21,22.76 21.18,22.94 v21.18,23.24 | v10.06,27.36 2.52,27.36 2.21,27.66 1.18,27.66 U2.39
  Bottom 0.152: v10.06,27.36 13.26,23.85 19.96,23.85 20.57,23.24 v21.18,23.24 20.88,22.94 20.88,21.41 21.24,21.05 RN4.3
RA7  (via drill 0.3)
  Top 0.152: U2.15 12.14,26.75 13.49,26.75 14.1,26.14 14.1,24.61 14.25,24.46 17.22,24.46 18.29,23.39 18.29,22.48 18.51,22.26 IC1.92 21.27,22.26 v21.64,22.63
  Bottom 0.152: v21.64,22.63 21.72,22.63 21.79,22.55 21.79,21.96 RN4.4
RA9  (via drill 0.3)
  Top 0.152: IC1.28 36.14,19.26 36.27,19.13 36.27,17.75 v36.8,17.3
  Bottom 0.152: v36.8,17.3 37.48,17.3 R16.2
RA10  (via drill 0.3)
  Top 0.152: IC1.29 36.1,19.76 36.58,19.28 36.58,18.29 v36.8,18.06
  Bottom 0.152: 39.85,16.3 U$1.1 | R16.1 38.4,14.85 U$1.1 | U$1.2 U$1.1 | v36.8,18.06 36.88,18.06 37.34,17.6 37.64,17.6 37.87,17.37 39.55,17.37 39.78,17.14 39.78,16.3 U$1.1
RA14  (via drill 0.3)
  Top 0.152: IC1.66 25.93,30.61 v25.76,30.4 | v24.08,37.8 24.08,36.96 24.38,36.65 26.59,36.65 28.04,35.2 v28.04,34.98 | R4.1 26.26,46.28 25.53,47.02 20.04,47.02 19.28,46.25 17.83,46.25 17.3,45.72 17.3,45.19 17.53,44.96 18.52,44.96 18.75,44.73 18.75,42.14 v19.13,41.76
  Bottom 0.152: v25.76,30.4 25.91,30.56 25.91,32.84 26.52,33.38 27.51,33.38 28.04,33.91 v28.04,34.98 | v19.13,41.76 19.13,40.62 19.43,40.31 23.09,40.31 23.55,39.93 23.55,38.1 23.77,37.8 v24.08,37.8
RA15  (via drill 0.3)
  Top 0.152: IC1.67 25.43,30.84 v24.84,30.25 | R5.1 20.98,44.76 20.34,44.12 20.34,42.29 v20.19,42.14 | v28.65,36.04 28.8,36.04 29.18,35.66 29.18,33.76 v28.96,33.53
  Bottom 0.152: v24.84,30.25 25.3,29.79 26.06,29.79 26.29,30.02 26.29,32.69 26.67,33.07 27.66,33.07 28.12,33.53 v28.96,33.53 | v20.19,42.14 20.19,41.07 20.34,40.92 24.38,40.92 24.77,40.54 24.77,37.11 24.99,36.88 27.89,36.88 v28.65,36.04
RB2  (via drill 0.3)
  Top 0.152: IC1.23 32.43,14.98 v31.93,14.48
  Bottom 0.152: v31.93,14.48 31.01,13.64 29.34,13.64 28.57,12.88 25.91,12.88 22.48,9.45 22.1,9.45 21.79,9.75 21.18,9.75 19.96,8.53 19.96,6.81 JP4.3
RB3  (via drill 0.3)
  Top 0.152: IC1.22 31.93,15.4 31.93,15.39 v31.85,15.24 | v18.29,8.23 18.29,7.67 JP4.4
  Bottom 0.152: v31.85,15.24 30.1,15.24 29.26,14.4 28.27,14.4 27.74,15.01 22.78,15.01 21.49,13.72 21.49,10.67 19.51,8.69 18.75,8.69 v18.29,8.23
RB4  (via drill 0.3)
  Top 0.152: v31.47,9.83 31.24,10.06 31.24,15.47 31.43,15.66 IC1.21 | v26.06,9.75 26.06,2.74 JP1.8
  Bottom 0.152: v26.06,9.75 30.25,9.75 30.56,10.06 31.24,10.06 v31.47,9.83
RB5  (via drill 0.3)
  Top 0.152: IC1.20 30.93,15.17 30.94,15.16 30.94,11.51 30.71,11.28 v30.71,9.45 | v23.32,9.22 23.32,8.53 23.62,8.23 23.62,2.85 JP1.9
  Bottom 0.152: v23.32,9.22 26.29,9.22 26.52,9.45 v30.71,9.45
RB6  (via drill 0.3)
  Top 0.152: v22.4,8.53 22.4,6.81 JP4.2 | IC1.26 34.26,18.26 34.14,18.14 34.14,14.1 32.92,12.88 32.92,11.12 33.38,10.67 33.38,10.13 32.84,9.6 v32.84,9.07
  Bottom 0.152: v32.84,9.07 32.84,8.61 32.38,8.15 29.95,8.15 29.34,8.84 26.82,8.84 26.36,8.38 22.55,8.38 v22.4,8.53
RB7  (via drill 0.3)
  Top 0.152: JP4.1 v24.99,9.75 | IC1.27 34.23,18.76 33.83,18.36 33.83,14.25 32.61,13.03 32.61,10.67 v32.84,10.44
  Bottom 0.152: v24.99,9.75 25.6,10.36 32.69,10.36 v32.84,10.44
RB8  (via drill 0.3)
  Top 0.152: IC1.32 36.05,21.26 36.2,21.11 36.2,20.12 37.34,18.97 37.34,13.64 34.21,10.52 v33.91,10.52 | v26.98,11.05 26.98,9.83 26.36,9.22 26.36,2.85 JP1.7
  Bottom 0.152: v26.98,11.05 32.99,11.05 33.53,10.52 v33.91,10.52
RB9  (via drill 0.3 pad 0.15)
  Top 0.152: IC1.33 36.31,21.76 36.5,21.57 36.5,20.27 37.64,19.13 37.64,13.49 33.76,9.6 v33.6,9.6 | JP1.6 31.09,2.69 v31.09,8.69
  Bottom 0.152: v31.09,8.69 31.55,8.69 32.38,9.6 v33.6,9.6
RB10
  Top 0.152: IC1.34 36.19,22.26 36.2,22.25 36.42,22.25 36.8,21.87 36.8,20.42 37.95,19.28 37.95,13.34 34.14,9.53 34.14,7.7 33.68,7.24 33.68,6.4 32.54,5.26 32.16,5.26 31.62,4.72 31.62,2.67 JP1.5
RB11
  Top 0.152: IC1.35 36.15,22.76 36.35,22.55 36.58,22.55 37.11,22.02 37.11,20.57 38.25,19.43 38.25,13.18 37.8,12.72 37.8,8.46 36.58,7.24 36.58,3.12 36.27,2.82 JP1.4
RB12  (via drill 0.3)
  Top 0.152: IC1.41 34.22,25.76 v33.98,25.53 | v41.3,8 41.6,7.7 v41.6,3.66
  Bottom 0.152: v33.98,25.53 34.14,25.53 34.75,24.92 34.75,13.41 35.05,13.03 35.05,10.06 35.74,9.45 40.39,9.45 41.3,8.53 v41.3,8 | v41.6,3.66 41.6,3.35 41,2.74 38.76,2.74 JP1.3
RB13  (via drill 0.3)
  Top 0.152: IC1.42 34.02,26.26 v33.98,26.29 | v39.32,8.31 39.32,7.47 39.17,7.32 39.17,3.66 39.62,3.2 41.25,3.2 JP1.1
  Bottom 0.152: v33.98,26.29 33.68,26.29 33.45,26.06 33.45,25.3 33.83,24.92 34.29,24.92 34.44,24.77 34.44,13.26 34.75,12.88 34.75,9.83 35.51,9.14 39.09,9.14 39.32,8.91 v39.32,8.31
RB14  (via drill 0.3)
  Top 0.152: IC1.43 34.43,26.76 34.14,27.05 v33.83,27.05 | v38.56,8.38 38.56,7.47 38.86,7.24 38.86,3.28 39.32,2.74 39.93,2.74 40.23,2.44 JP1.2
  Bottom 0.152: v33.83,27.05 33.6,27.05 33.15,26.59 33.15,25.15 33.68,24.61 33.98,24.61 34.14,24.46 34.14,13.11 34.44,12.72 34.44,9.68 35.36,8.84 38.41,8.84 38.56,8.69 v38.56,8.38
RB15  (via drill 0.3)
  Top 0.152: IC1.44 36.29,27.26 v36.58,26.98 | v36.96,10.82 36.12,9.98 v36.12,8
  Bottom 0.152: v36.58,26.98 36.27,26.67 36.27,14.86 37.19,13.95 37.19,12.12 37.49,11.81 37.49,11.12 37.11,10.82 v36.96,10.82 | v36.12,8 36.12,7.32 36.2,7.24 36.2,6.25 35.66,5.71 29.79,5.71 28.35,4.27 27.58,4.27 JP6.1
RC1  (via drill 0.3)
  Top 0.152: IC1.6 23.93,15.62 24.08,15.47 24.08,13.11 23.16,12.19 20.73,12.19 18.59,10.06 17.37,10.06 15.77,8.46 9.6,8.46 v9.14,8 | v8,8.53 6.18,8.53 R14.1 R30.2
  Bottom 0.152: v9.14,8 8.53,8 v8,8.53
RC2
  Top 0.152: IC1.7 24.43,13 23.32,11.89 20.88,11.89 18.75,9.75 17.53,9.75 15.93,8.15 11.15,8.15 JP3.3
RC3
  Top 0.152: IC1.8 24.93,15.64 24.77,15.47 24.77,12.88 23.47,11.58 21.03,11.58 18.9,9.45 17.68,9.45 16.08,7.85 13.39,7.85 JP3.2
RC4
  Top 0.152: IC1.9 25.43,15.68 25.07,15.32 25.07,12.72 23.62,11.28 21.18,11.28 19.05,9.14 17.83,9.14 15.39,6.71 14.88,6.71 JP3.1
RC13  (via drill 0.3)
  Top 0.152: IC1.73 22.43,33.12 22.25,33.3 20.12,33.3 19.05,32.23 v19.05,32 | v25.53,35.81 25.38,36.04 23.7,36.04 23.24,36.5 23.24,38.33 v23.01,38.56 | R2.1 17.88,41.86 v17.91,41.22
  Bottom 0.152: v19.05,32 19.05,32.08 18.75,32.69 18.75,35.13 19.89,36.27 25.22,36.27 v25.53,35.81 | v17.91,41.22 17.91,40.46 18.36,40.01 22.78,40.01 23.01,39.78 v23.01,38.56
RC14  (via drill 0.3)
  Top 0.152: IC1.74 21.93,32.86 21.79,32.99 20.27,32.99 19.81,32.54 v19.81,32 | v26.29,35.81 25.91,36.35 23.85,36.35 23.55,36.65 23.55,38.18 23.93,38.56 v24.08,38.56 | R3.1 19.56,42.88 v19.66,42.75
  Bottom 0.152: v19.81,32 19.81,32.23 19.2,32.84 19.2,35.13 19.81,35.74 24.61,35.74 25.22,35.13 25.22,33.76 25.3,33.68 27.36,33.68 27.51,33.83 27.51,35.51 27.2,35.81 v26.29,35.81 | v19.66,42.75 19.66,40.84 19.89,40.62 23.77,40.62 24.08,40.31 v24.08,38.56
RD0  (via drill 0.3)
  Top 0.152: IC1.72 22.93,30.63 v22.86,30.56
  Bottom 0.152: R17.2 v22.86,30.56
RD1
  Top 0.152: IC1.76 18.9,30.25 18.82,30.25 18.36,29.79 17.75,29.79 15.77,31.85 15.77,34.14 14.33,35.59 12.1,35.59 U2.26
RD2  (via drill 0.3)
  Top 0.152: U2.29 1.26,35.74 5.11,35.74 6.33,36.96 13.64,36.96 16.08,34.67 16.08,32.08 17.53,30.56 17.98,30.56 v18.14,30.33 | IC1.77 18.86,29.76 18.36,29.26 v18.14,29.26
  Bottom 0.152: v18.14,30.33 v18.14,29.26
RD3  (via drill 0.3)
  Top 0.152: U2.30 2.43,34.84 v2.67,34.82 | v3.35,37.11 3.81,37.26 14.02,37.26 16.38,34.98 16.38,32.23 17.68,30.86 18.44,30.86 18.67,30.63 20.57,30.63 20.73,30.48 20.73,29.41 20.57,29.26 IC1.78
  Bottom 0.152: v2.67,34.82 2.67,36.42 v3.35,37.11
RD4  (via drill 0.3)
  Top 0.152: IC1.81 18.5,27.76 17.68,28.57 16.92,28.57 16.46,29.03 v16.46,29.64 | v10.06,32.69 3.5,32.69 2.13,34.06 1.18,34.06 U2.31
  Bottom 0.152: v16.46,29.64 16.46,30.71 15.54,31.62 11.28,31.62 v10.06,32.69
RD5  (via drill 0.3)
  Top 0.152: IC1.82 18.54,27.26 17.53,28.27 16.76,28.27 15.93,29.11 15.93,30.33 v15.39,30.86 | v10.06,31.93 3.66,31.93 2.29,33.3 1.22,33.3 U2.32
  Bottom 0.152: v15.39,30.86 11.12,30.86 v10.06,31.93
RD6  (via drill 0.3)
  Top 0.152: IC1.83 18.58,26.76 17.37,27.96 16.54,27.96 15.39,29.11 v15.39,29.95 | v10.06,31.17 9.98,31.17 9.75,31.39 3.58,31.39 2.59,32.38 1.2,32.38 U2.33
  Bottom 0.152: v15.39,29.95 11.28,29.95 v10.06,31.17
RD7  (via drill 0.3)
  Top 0.152: IC1.84 21.15,26.26 21.95,27.05 21.95,28.27 21.03,29.26 21.03,30.63 20.73,30.94 18.82,30.94 18.59,31.17 17.83,31.17 16.69,32.38 16.69,35.13 14.17,37.57 4.5,37.57 v4.04,38.02 | v3.12,31.01 3.05,31.01 2.44,31.62 1.17,31.62 U2.34
  Bottom 0.152: v4.04,38.02 4.04,37.03 3.2,36.2 3.2,31.47 3.12,31.39 v3.12,31.01
RD8  (via drill 0.3)
  Top 0.152: U2.22 13.67,32.44 v13.72,32.38 | v17.91,34.67 18.59,34.67 18.75,34.52 23.47,34.52 24.93,33.06 IC1.68
  Bottom 0.152: v13.72,32.38 16.54,32.38 16.69,32.54 16.69,33.45 v17.91,34.67
RD9  (via drill 0.3)
  Top 0.152: U2.35 2.24,30.84 2.67,30.4 v10.06,30.4 | v17.91,33.91 18.75,33.91 19.05,34.21 23.16,34.21 24.43,32.95 IC1.69
  Bottom 0.152: v10.06,30.4 11.43,29.03 16.76,29.03 16.99,29.26 16.99,33.3 17.6,33.91 v17.91,33.91
RD10  (via drill 0.3)
  Top 0.152: IC1.70 23.93,32.99 23.01,33.91 19.36,33.91 18.44,32.99 v18.14,32.99 | v10.06,29.64 2.59,29.64 2.21,30.02 1.17,30.02 U2.36
  Bottom 0.152: v18.14,32.99 17.98,32.99 17.3,32.23 17.3,28.96 17.07,28.73 11.12,28.73 10.21,29.64 v10.06,29.64
RD11  (via drill 0.3)
  Top 0.152: IC1.71 23.43,32.88 22.71,33.6 19.81,33.6 18.44,32.23 v18.29,32.23 | v10.06,28.88 2.59,28.88 2.21,29.26 1.18,29.26 U2.37 | v23.93,28.73 23.93,26.29 v23.77,26.14
  Bottom 0.152: v18.29,32.23 17.83,32.23 17.6,32 17.6,28.73 | 17.6,28.73 17.3,28.42 10.82,28.42 10.36,28.88 v10.06,28.88 | RN4.1 22.57,19.45 22.71,19.58 22.71,22.78 23.77,23.85 v23.77,26.14 | 17.6,28.73 v23.93,28.73
RD12  (via drill 0.3)
  Top 0.152: v32.46,39.4 33.53,39.4 33.76,39.17 39.47,39.17 40.39,38.25 40.39,36.04 40.08,35.74 40.08,34.82 39.4,34.14 v39.4,33.6 | IC1.79 21,28.76 21.41,28.35 v21.41,27.66
  Bottom 0.152: U$12.1 35.84,46.7 R20.1 34.59,45.72 34.29,45.41 33.53,45.41 32.77,44.65 32.77,40.08 32.46,39.78 v32.46,39.4 | v21.41,27.66 22.02,27.05 23.77,27.05 24.54,27.81 24.54,28.88 25.15,29.49 26.21,29.49 26.59,29.87 26.59,32.38 26.98,32.77 29.95,32.77 30.02,32.84 38.71,32.84 v39.4,33.6
RD13  (via drill 0.3)
  Top 0.152: R13.2 26.58,44.59 27.43,43.74 27.43,42.06 27.74,41.76 T1.1 | 28.35,41.76 28.35,41.55 T1.1 | IC1.80 20.74,28.26 20.88,28.12 20.88,27.05 v21.03,26.9 | v39.62,32.84 39.62,33.07 39.93,33.38 39.93,34.21 40.39,34.67 40.39,35.59 40.69,35.89 40.69,38.41 39.24,39.85 39.24,41.83 38.25,42.82 36.73,42.82 36.2,43.43 35.2,43.43 34.75,43.89 33.45,43.89 32.92,43.36 32.92,42.22 32.69,41.99 29.64,41.99 29.41,41.76 T1.1
  Bottom 0.152: v21.03,26.9 21.18,26.9 21.34,26.75 23.93,26.75 24.84,27.66 24.84,28.73 25.3,29.18 26.36,29.18 26.9,29.72 26.9,32.08 27.28,32.46 30.1,32.46 30.18,32.54 38.86,32.54 39.17,32.84 v39.62,32.84
RE0
  Top 0.152: IC1.93 16.15,21.76 RN2.4
RE1
  Top 0.152: IC1.94 18.9,21.26 18.75,21.41 17.07,21.41 16.46,20.8 16.08,20.8 RN2.3
RE2
  Top 0.152: IC1.98 17.24,19.26 16.46,20.04 16.05,20.04 RN2.2
RE3
  Top 0.152: IC1.99 17.06,18.76 16.54,19.28 16.07,19.28 RN2.1
RE4
  Top 0.152: IC1.100 18.39,18.26 18.29,18.36 16.38,18.36 16.08,18.06 16.08,17.62 RN1.4
RE5
  Top 0.152: IC1.3 22.43,15.65 22.25,15.47 17.83,15.47 16.46,16.84 16.1,16.84 RN1.3
RE6
  Top 0.152: IC1.4 22.93,15.54 22.55,15.16 17.37,15.16 16.61,15.93 16.1,15.93 RN1.2
RE7
  Top 0.152: IC1.5 23.43,15.43 22.86,14.86 17.14,14.86 16.69,15.32 16.17,15.32 RN1.1
RE8  (via drill 0.3)
  Top 0.152: IC1.18 29.93,14.42 v30.02,14.4 | v22.25,10.06 21.34,10.06 20.88,9.6 20.88,8.53 21.03,8.38 21.03,3.5 20.57,3.05 18.75,3.05 JP1.11
  Bottom 0.152: v30.02,14.4 29.64,13.95 23.32,13.95 22.55,13.18 22.55,10.36 v22.25,10.06
RE9  (via drill 0.3)
  Top 0.152: IC1.19 30.43,14.83 30.63,14.63 30.63,11.66 30.02,11.05 v30.02,8.91 | v21.49,9.14 21.49,8.53 21.34,8.38 21.34,3.1 JP1.10
  Bottom 0.152: v30.02,8.91 29.79,9.14 26.67,9.14 26.21,8.69 23.01,8.69 22.55,9.14 v21.49,9.14
RF0  (via drill 0.3)
  Top 0.152: IC1.87 18.75,24.76 18.44,25.07 18.44,26.44 17.22,27.66 16.38,27.66 14.86,29.18 14.86,33.07 v15.24,33.45 | v13.72,33.15 12.14,33.15 U2.23
  Bottom 0.152: v15.24,33.45 14.02,33.45 v13.72,33.15
RF1
  Top 0.152: IC1.88 18.8,24.26 18.14,24.92 18.14,26.29 17.07,27.36 16.23,27.36 14.55,29.03 14.55,33.53 14.02,34.06 12.08,34.06 U2.24
RF2  (via drill 0.3)
  Top 0.152: v14.17,34.82 12.07,34.82 U2.25 | IC1.52 32.93,32.75 32.23,33.45 32.23,35.05 v32.31,35.13
  Bottom 0.152: v32.31,35.13 31.93,35.51 28.04,35.51 26.98,36.58 19.74,36.58 18.44,35.28 17.53,35.28 17.22,34.98 14.33,34.98 v14.17,34.82
RF3  (via drill 0.3)
  Top 0.152: v39.24,37.03 39.24,37.19 38.79,37.64 36.5,37.64 36.04,37.19 v36.04,36.42 35.43,35.74 34.9,35.74 34.67,35.51 34.67,33.45 34.37,33.15 33.68,33.15 33.43,32.9 IC1.51
  Bottom 0.152: IC2.6 v36.05,36.43 v36.04,36.42 | IC2.1 39.3,37.09 v39.24,37.03
RF8  (via drill 0.3)
  Top 0.152: v32.16,38.63 31.7,38.1 31.7,34.9 31.93,34.67 31.93,33.3 32.43,32.8 IC1.53 | v38.18,42.06 38.18,42.29 37.95,42.52 36.27,42.52 v35.97,42.82 35.36,42.82 34.59,43.59 33.6,43.59 33.22,43.2 33.22,41.83 32.77,41.38 v32.16,41.38
  Bottom 0.152: IC2.15 36.05,42.9 v35.97,42.82 | v32.16,41.38 31.93,41.15 31.93,39.17 32.16,38.94 v32.16,38.63 | IC2.19 38.65,42.53 v38.18,42.06
RG0
  Top 0.152: IC1.90 18.88,23.26 17.53,24.61 17.53,25.98 16.76,26.75 15.93,26.75 13.95,28.73 13.95,30.18 13.26,30.86 12.08,30.86 U2.20
RG1
  Top 0.152: IC1.89 18.84,23.76 17.83,24.77 17.83,26.14 16.92,27.05 16.08,27.05 14.25,28.88 14.25,30.79 13.41,31.62 12.07,31.62 U2.21
RG12  (via drill 0.3)
  Top 0.152: IC1.96 17.92,20.26 v17.83,20.27 | v17.07,22.48 17.07,22.63 16.92,22.78 16.61,22.78 16.15,23.24 16.15,23.45 RN3.7
  Bottom 0.152: v17.83,20.27 17.83,21.72 v17.07,22.48
RG13  (via drill 0.3)
  Top 0.152: IC1.97 18.92,19.76 18.82,19.66 17.6,19.66 17.3,19.96 v17.3,20.88 | v15.85,22.48 15.7,22.48 15.39,22.78 15.39,23.41 RN3.6
  Bottom 0.152: v17.3,20.88 17.3,21.34 v15.85,22.48
RG14  (via drill 0.3)
  Top 0.152: IC1.95 18.49,20.76 v18.44,20.8 | v17.68,23.09 17.53,23.18 RN3.8
  Bottom 0.152: v17.68,23.09 18.44,22.33 v18.44,20.8 18.99,20.25 RN4.2
RG15  (via drill 0.3)
  Top 0.152: v15.39,18.36 15.39,21.95 14.63,22.71 14.63,23.68 RN3.5 | IC1.1 21.43,17.43 21.34,17.53 v17.91,17.53
  Bottom 0.152: v17.91,17.53 16.99,17.53 16.15,18.36 v15.39,18.36
SCK4  (via drill 0.3)
  Top 0.152: v38.41,40.46 38.25,40.62 36.96,40.62 36.8,40.77 36.8,41.15 36.35,41.6 34.21,41.6 v33.83,42.06 | 37.19,24.76 37.5,24.45 37.72,24.23 37.72,20.88 38.86,19.74 38.86,13.18 40.21,11.84 JP8.1 | 37.19,24.76 IC1.39 | 37.19,24.76 37.19,28.04 36.58,28.65 36.58,32.31 37.57,33.3 37.57,35.89 38.48,36.8 v38.48,37.03
  Bottom 0.152: v33.83,42.06 33.45,42.57 IC2.11 | v38.41,40.46 38.41,39.09 38.65,38.85 IC2.2 38.65,37.2 v38.48,37.03
SCL2  (via drill 0.3)
  Top 0.152: v30.48,33.68 30.48,33.45 29.95,32.92 29.93,32.86 IC1.58 29.93,31.1 30.02,31.01 30.02,29.57 v30.56,28.96 | v29.03,11.58 28.57,11.12 v28.57,7.77 | v33.91,11.28 34.21,11.28 36.04,13.11 v36.04,13.18
  Bottom 0.152: v30.48,33.68 30.63,33.45 37.95,33.45 38.94,34.44 40.01,34.44 40.23,34.21 41.52,34.21 R10.1 43.13,34.23 43.13,36.96 44.73,38.33 44.73,41.99 44.96,42.22 46.41,42.22 46.69,41.94 IC4.6 | v30.56,28.96 31.01,28.96 32.16,30.1 33.68,30.1 35.36,28.42 35.36,14.4 36.04,13.72 v36.04,13.18 36.04,12.88 35.66,12.5 35.66,10.44 36.04,10.06 48.54,10.06 48.84,10.36 48.84,17.04 U$2.16 47.9,17.91 46.63,17.91 46.02,17.3 41.3,17.3 40.65,17.95 IC5.4 | v29.03,11.58 33.15,11.58 33.45,11.28 v33.91,11.28 | v28.57,7.77 28.98,7.77 JP7.6
SDA2  (via drill 0.3)
  Top 0.152: v29.72,33.53 29.43,33.2 IC1.59 29.43,31.15 29.72,30.86 v29.72,28.88 | v29.64,12.12 28.73,12.12 27.89,11.28 27.89,7.09 27.58,6.78 27.58,6.81 JP7.7 | v33.91,12.04 34.21,12.04 35.28,13.11 v35.28,13.72
  Bottom 0.152: v29.72,33.53 30.02,33.15 38.1,33.15 39.09,34.14 39.78,34.14 40.39,33.53 40.39,33.45 40.5,33.45 R9.1 40.84,32.84 41.07,32.61 43.05,32.61 43.43,32.99 43.43,36.73 45.03,38.18 45.03,39.93 45.34,40.31 IC4.5 | v29.72,28.88 30.18,28.42 30.94,28.42 32.31,29.79 33.53,29.79 35.05,28.27 35.05,13.95 v35.28,13.72 35.28,13.34 35.36,13.26 35.36,10.29 35.89,9.75 48.69,9.75 49.15,10.21 49.15,17.07 49.3,17.22 49.3,18.9 49.15,19.05 47.95,19.05 U$2.15 47.9,19.13 46.63,19.13 46.02,18.52 41.38,18.52 41.22,18.67 41.22,19.66 41,19.89 38.94,19.89 38.75,19.7 IC5.5 | v29.64,12.12 33.83,12.12 v33.91,12.04
TCK
  Top 0.152: IC1.38 36.52,24.26 36.58,24.31 37.19,24.31 37.41,24.08 37.41,20.73 38.56,19.58 38.56,9.92 R19.1
TDI  (via drill 0.3, 0.3 pad 0.15)
  Top 0.152: IC1.60 28.93,30.89 v29.11,30.71 | v36.96,11.58 37.34,11.58 37.49,11.43 37.49,8.61 36.27,7.39 36.27,5.33 JP6.4
  Bottom 0.152: v29.11,30.71 33.98,30.71 35.97,28.73 35.97,14.71 36.88,13.79 36.88,11.66 v36.96,11.58
TDO  (via drill 0.3)
  Top 0.152: IC1.61 28.43,30.32 v28.5,30.25 | v36.2,10.82 35.97,10.82 34.44,9.3 34.44,7.54 33.98,7.09 33.98,5.59 JP6.3
  Bottom 0.152: v28.5,30.25 28.57,30.18 29.34,30.18 29.57,30.4 33.83,30.4 35.66,28.57 35.66,14.55 36.58,13.64 36.58,12.88 36.2,12.5 v36.2,10.82
TMS
  Top 0.152: IC1.17 29.41,14.1 30.18,13.41 30.18,11.81 29.43,10.99 29.43,7.64 29.03,7.24 29.03,5.26 JP6.2
U3RX  (via drill 0.3)
  Top 0.152: v24.99,17.91 25.15,17.75 26.06,17.75 26.43,17.38 IC1.11 26.43,15.61 25.68,14.86 25.68,12.42 23.93,10.67 21.49,10.67 18.9,8.08 18.9,5.23 JP2.2
  Bottom 0.152: v24.99,17.91 24.99,18.14 25.6,18.75 R6.2
U3TX
  Top 0.152: JP2.4 23.93,5.28 23.93,10.21 25.98,12.27 25.98,14.71 26.93,15.65 IC1.12
U6RX  (via drill 0.3)
  Top 0.152: v27.58,17.91 27.93,17.41 IC1.14 27.93,15.27 28.35,14.86 v28.35,13.41 | v23.47,13.34 23.47,13.03 23.01,12.5 20.57,12.5 18.44,10.36 17.22,10.36 15.62,8.76 9.14,8.76 8.31,7.92 8.31,5.66 JP5.2
  Bottom 0.152: v27.58,17.91 27.58,17.98 28.8,19.2 R7.2 | v23.47,13.34 28.27,13.34 v28.35,13.41
U6TX
  Top 0.152: IC1.10 25.93,15.64 25.38,15.09 25.38,12.57 23.77,10.97 21.34,10.97 19.2,8.84 17.98,8.84 15.85,6.71 15.85,5.08 JP5.4
VBUS  (via drill 0.3)
  Top 0.152: IC1.54 31.93,32.84 31.62,33.15 31.62,34.52 31.39,34.75 31.39,35.66 29.57,37.57 25.3,37.57 25.22,37.64 25.22,39.4 24.31,40.31 18.9,40.31 18.59,40.01 14.48,40.01 13.95,40.54 13.95,40.84 13.72,41.07 13.11,41.07 12.88,41.38
  Top 0.254: 1.5 12.57,39.47 12.34,39.7 12.34,40.84 12.88,41.38 13.03,41.53 USB1.VBUS | USB1.VBUS
  Top 0.406: v14.02,42.98 13.04,42.98 USB1.VBUS
  Bottom 0.406: v14.02,42.98 5.64,42.98 1.37,38.33 1.37,10.06 2.59,8.84 4.12,8.84 4.57,9.3 4.57,12.34 5.18,12.95 12.65,12.95 14.78,15.09 D3.A

## Text on the board
tPlace: RESET | 1 | A B C D E F G H I J K L M N O | 2 | 3
bPlace: RetroBSD PCB 1.1 | http://jaromir.xf.cz/ | http://retrobsd.org/ | 1 | O N M L K J I H G F E D C B A | 2 | 3